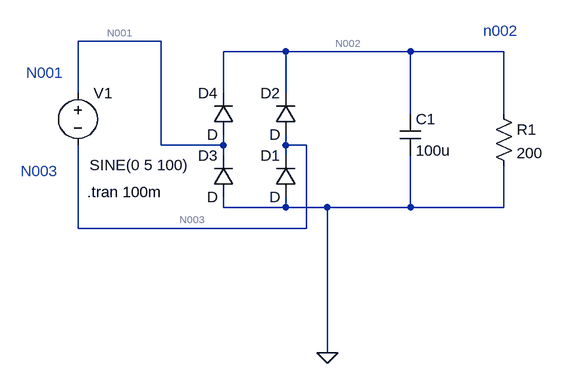
[diagram p0: schematic Yoneda-p88__Full-rectifier__with-C=100u.asc]
Yoneda-p88__Full-rectifier__with-C=100u.asc, the LTspice schematic file:
Version 4
SHEET 1 916 680
WIRE -576 -48 -704 -48
WIRE -384 -32 -480 -32
WIRE -192 -32 -384 -32
WIRE -48 -32 -192 -32
WIRE -704 32 -704 -48
WIRE -480 32 -480 -32
WIRE -384 32 -384 -32
WIRE -192 64 -192 -32
WIRE -48 64 -48 -32
WIRE -576 112 -576 -48
WIRE -480 112 -480 96
WIRE -480 112 -576 112
WIRE -384 112 -384 96
WIRE -352 112 -384 112
WIRE -480 128 -480 112
WIRE -384 128 -384 112
WIRE -480 208 -480 192
WIRE -384 208 -384 192
WIRE -384 208 -480 208
WIRE -320 208 -384 208
WIRE -192 208 -192 128
WIRE -192 208 -320 208
WIRE -48 208 -48 144
WIRE -48 208 -192 208
WIRE -704 240 -704 112
WIRE -352 240 -352 112
WIRE -352 240 -704 240
WIRE -320 432 -320 208
FLAG -320 432 0
SYMBOL diode -368 192 R180
WINDOW 0 24 64 Left 2
WINDOW 3 24 0 Left 2
SYMATTR InstName D1
SYMBOL diode -368 96 R180
WINDOW 0 24 64 Left 2
WINDOW 3 24 0 Left 2
SYMATTR InstName D2
SYMBOL diode -464 192 R180
WINDOW 0 24 64 Left 2
WINDOW 3 24 0 Left 2
SYMATTR InstName D3
SYMBOL diode -464 96 R180
WINDOW 0 24 64 Left 2
WINDOW 3 24 0 Left 2
SYMATTR InstName D4
SYMBOL res -64 48 R0
SYMATTR InstName R1
SYMATTR Value 200
SYMBOL voltage -704 16 R0
WINDOW 3 18 127 Left 2
WINDOW 123 0 0 Left 2
WINDOW 39 0 0 Left 2
SYMATTR InstName V1
SYMATTR Value SINE(0 5 100)
SYMBOL cap -208 64 R0
SYMATTR InstName C1
SYMATTR Value 100u
TEXT -690 184 Left 2 !.tran 100m
TEXT -784 0 Left 2 ;N001
TEXT -792 152 Left 2 ;N003
TEXT -80 -64 Left 2 ;n002

The netlist it stands for:
* Yoneda-p88__Full-rectifier__with-C=100u.asc
D1 0 N003 D
D2 N003 N002 D
D3 0 N001 D
D4 N001 N002 D
R1 N002 0 200
V1 N001 N003 SINE(0 5 100)
C1 N002 0 100u
.model D D
.lib standard.dio
.tran 100m
* N001
* N003
* n002
.backanno
.end

* Results of the author's LTspice run, read from the files saved beside the schematic
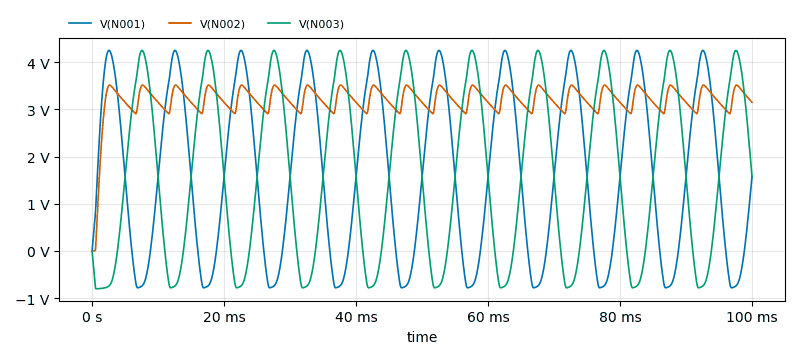
[diagram p1: Transient Analysis of Yoneda-p88__Full-rectifier__with-C=100u.asc, plotted from the saved traces]
* Transient Analysis, 1 run:
*   V(N001): min -781.4 mV, max 4.25 V, average 1.594 V, rms 2.382 V, last 1.574 V
*   V(N002): min 0 V, max 3.515 V, average 3.188 V, rms 3.209 V, last 3.148 V
*   V(N003): min -802 mV, max 4.25 V, average 1.594 V, rms 2.394 V, last 1.574 V